# Altium project FMC-320U-A1.PrjPcb
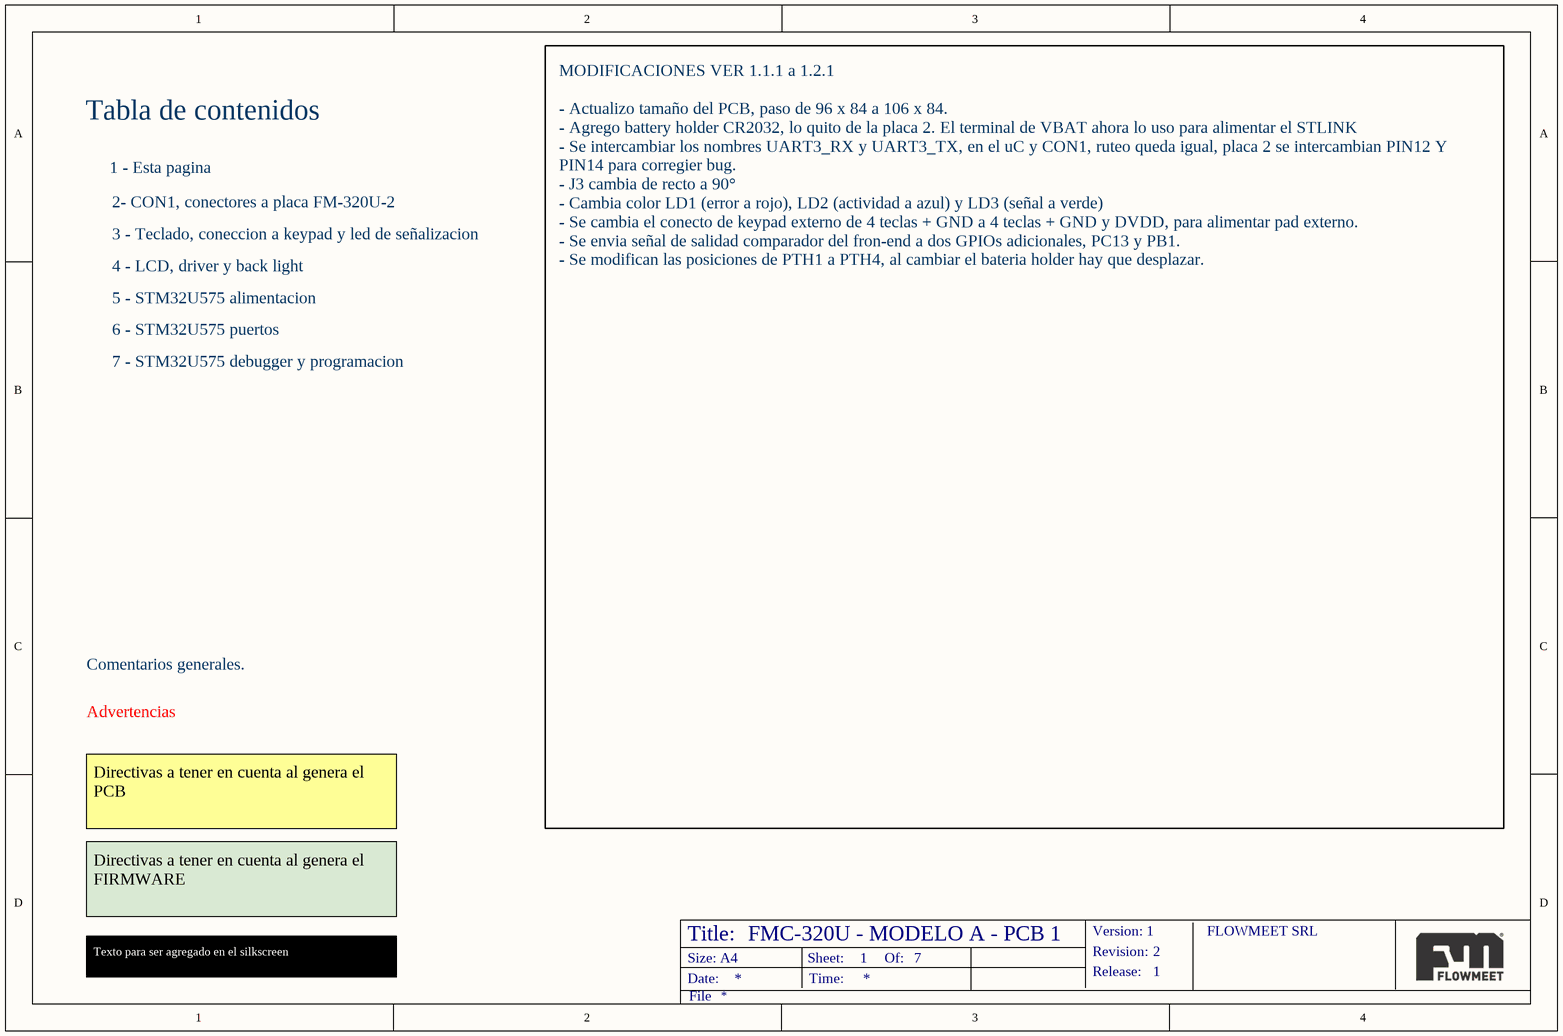
[diagram p0: READ_1.SchDoc]
6 sheets, 70 parts. Net scope: flat (ports and power ports of the same name join across sheets).
Board file: FMC-320U-A1.PcbDoc
Sheets:
  READ_1.SchDoc
  CON1.SchDoc
  KEY.SchDoc
  MCU_PWR.SchDoc
  MCU_IO.SchDoc
  MCU_DBG.SchDoc

## Sheet READ_1.SchDoc: FMC-320U - MODELO A - PCB 1
size A4; SheetNumber: 1; SheetTotal: 7; thisVersion: 1; ThisRevision: 2; ThisRelease: 1

### Notes on the sheet
- Tabla de contenidos
- 1 - Esta pagina
- 2- CON1, conectores a placa FM-320U-2
- 3 - Teclado, coneccion a keypad y led de señalizacion
- 4 - LCD, driver y back light
- 5 - STM32U575 alimentacion
- 6 - STM32U575 puertos
- 7 - STM32U575 debugger y programacion
- Comentarios generales.
- Advertencias
- Directivas a tener en cuenta al genera el PCB
- MODIFICACIONES VER 1.1.1 a 1.2.1
  - Actualizo tamaño del PCB, paso de 96 x 84 a 106 x 84.
  - Agrego battery holder CR2032, lo quito de la placa 2. El terminal de VBAT ahora lo uso para alimentar el STLINK
  - Se intercambiar los nombres UART3_RX y UART3_TX, en el uC y CON1, ruteo queda igual, placa 2 se intercambian PIN12 Y PIN14 para corregier bug.
  - J3 cambia de recto a 90°
  - Cambia color LD1 (error a rojo), LD2 (actividad a azul) y LD3 (señal a verde)
  - Se cambia el conecto de keypad externo de 4 teclas + GND a 4 teclas + GND y DVDD, para alimentar pad externo.
  - Se envia señal de salidad comparador del fron-end a dos GPIOs adicionales, PC13 y PB1.
  - Se modifican las posiciones de PTH1 a PTH4, al cambiar el bateria holder hay que desplazar.
- Directivas a tener en cuenta al genera el FIRMWARE
- Texto para ser agregado en el silkscreen
- Title:
- Size: A4
- Date:
- Sheet:
- Time:
- Of:
- Version:
- Revision:
- Release:
- FLOWMEET SRL
- File

## Sheet CON1.SchDoc
size A4; SheetNumber: 1; SheetTotal: 6
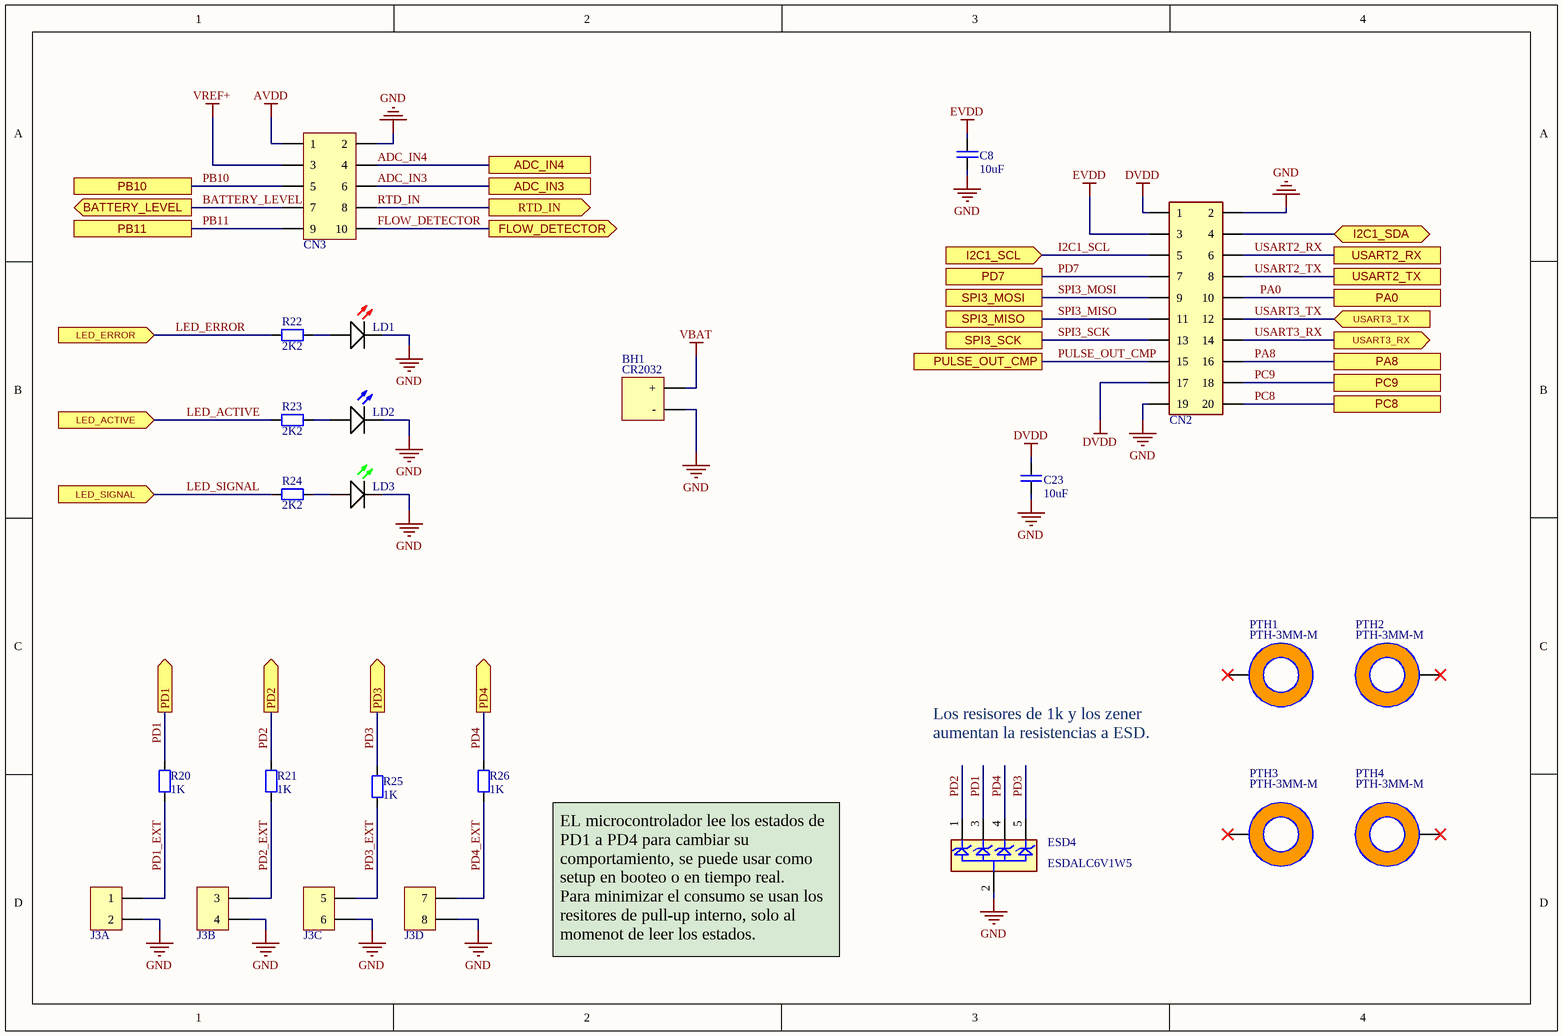
[diagram p1: CON1.SchDoc]

### Parts
BH1  CR2032  [BS-08-B2AA016]
C8  10uF  [CAP_SM0805_YAGEOCC2_N]
C23  10uF  [CAP_SM0805_YAGEOCC2_N]
CN2  DW254R-22-20-85  [DW254R-22-10-85]  (value not drawn)
CN3  DW254S-22-10-85  [2X5 100 MILS SMD]  (value not drawn)
ESD4  ESDALC6V1W5  [ESDALC6V1W5]
J3  PH2.54-07-04PWS-JUMPER  [HEADER PIN 2X4 A 90 GRADOS]  (value not drawn)  (parts A,B,C,D of 4)
LD1  ERROR  [LED 0805]  (value not drawn)
LD2  RUN  [LED 0805]  (value not drawn)
LD3  SGINAL  [LED 0805]  (value not drawn)
PTH1  PTH-3MM-M  [PTH_M3_M]  (no BOM)
PTH2  PTH-3MM-M  [PTH_M3_M]  (no BOM)
PTH3  PTH-3MM-M  [PTH_M3_M]  (no BOM)
PTH4  PTH-3MM-M  [PTH_M3_M]  (no BOM)
R20  1K  [RES_SM0805_YAGEORC_N]
R21  1K  [RES_SM0805_YAGEORC_N]
R22  2K2  [RES_SM0805_YAGEORC_N]
R23  2K2  [RES_SM0805_YAGEORC_N]
R24  2K2  [RES_SM0805_YAGEORC_N]
R25  1K  [RES_SM0805_YAGEORC_N]
R26  1K  [RES_SM0805_YAGEORC_N]

### Ports
ADC_IN3, ADC_IN4, BATTERY_LEVEL (out), FLOW_DETECTOR (out), I2C1_SCL (in), I2C1_SDA (bidir), LED_ACTIVE (in), LED_ERROR (in), LED_SIGNAL (in), PA0, PA8, PB10, PB11, PC8, PC9, PD1 (out), PD2 (out), PD3 (out), PD4 (out), PD7, PULSE_OUT_CMP, RTD_IN (out), SPI3_MISO, SPI3_MOSI, SPI3_SCK, USART2_RX, USART2_TX, USART3_RX (out), USART3_TX (in)

### Nets
AVDD: CN3.1
DVDD: C23.2 CN2.1 CN2.17
EVDD: C8.2 CN2.3
GND: BH1.NEG(-) C8.1 C23.1 CN2.2 CN2.19 CN3.2 ESD4.2(GND) J3.2 J3.4 J3.6 J3.8 LD1.K LD2.K LD3.K
VBAT: BH1.POS(+)
VREF+: CN3.3
ADC_IN3: CN3.6 ; port ADC_IN3
ADC_IN4: CN3.4 ; port ADC_IN4
BATTERY_LEVEL: CN3.7 ; port BATTERY_LEVEL
FLOW_DETECTOR: CN3.10 ; port FLOW_DETECTOR
I2C1_SCL: CN2.5 ; port I2C1_SCL
I2C1_SDA: CN2.4 ; port I2C1_SDA
LED_ACTIVE: R23.1 ; port LED_ACTIVE
LED_ERROR: R22.1 ; port LED_ERROR
LED_SIGNAL: R24.1 ; port LED_SIGNAL
PA0: CN2.10 ; port PA0
PA8: CN2.16 ; port PA8
PB10: CN3.5 ; port PB10
PB11: CN3.9 ; port PB11
PC8: CN2.20 ; port PC8
PC9: CN2.18 ; port PC9
PD1: ESD4.3(I/02) R20.2 ; port PD1
PD1_EXT: J3.1 R20.1
PD2: ESD4.1(I/01) R21.2 ; port PD2
PD2_EXT: J3.3 R21.1
PD3: ESD4.5(I/04) R25.2 ; port PD3
PD3_EXT: J3.5 R25.1
PD4: ESD4.4(I/03) R26.2 ; port PD4
PD4_EXT: J3.7 R26.1
PD7: CN2.7 ; port PD7
PULSE_OUT_CMP: CN2.15 ; port PULSE_OUT_CMP
RTD_IN: CN3.8 ; port RTD_IN
SPI3_MISO: CN2.11 ; port SPI3_MISO
SPI3_MOSI: CN2.9 ; port SPI3_MOSI
SPI3_SCK: CN2.13 ; port SPI3_SCK
USART2_RX: CN2.6 ; port USART2_RX
USART2_TX: CN2.8 ; port USART2_TX
USART3_RX: CN2.14 ; port USART3_RX
USART3_TX: CN2.12 ; port USART3_TX
NetLD1_A: LD1.A R22.2
NetLD2_A: LD2.A R23.2
NetLD3_A: LD3.A R24.2

Not connected (* = marked no-connect by the designer): PTH1 1*; PTH2 1*; PTH3 1*; PTH4 1*

### Notes on the sheet
- Los resisores de 1k y los zener aumentan la resistencias a ESD.
- EL microcontrolador lee los estados de PD1 a PD4 para cambiar su comportamiento, se puede usar como setup en booteo o en tiempo real.
  Para minimizar el consumo se usan los resitores de pull-up interno, solo al momenot de leer los estados.
- Title:
- Size: A4
- Date:
- Sheet:
- Time:
- Of:
- Version:
- Revision:
- Release:
- FLOWMEET SRL
- File

### Library data of the parts
BH1 = BS-08-B2AA016: Battery base -25℃~+85℃ CR2032 SMD Battery Connectors ROHS; Manufacturer: Myoung; Manufacturer part number: BS-08-B2AA016; Category: Battery holder; Datasheet: https://datasheet.lcsc.com/lcsc/2012181809_MYOUNG-BS-08-B2AA016_C964792.pdf; Temperature Max: 85; Temperature Min: -25
C8 C23 = CC0805KKX5R8BB106: CAP 10uF SM0805 X5R 25V YAGEO; Tolerance: 10; Category: Capacitor; Manufacturer: Yageo; Manufacturer Part Number: CC0805KKX5R8BB106; Package: 0805; Value: 10uF; ComponentLink1Description: Manufacturer Website; ComponentLink1URL: http://www.yageo.com; Datasheet: https://datasheet.lcsc.com/lcsc/2304140030_YAGEO-CC0805KKX5R8BB106_C89831.pdf
CN2 = DW254R-22-20-85: 2 x 10 - true hole 2.54mm - altura 8.5mm; Manufacturer: Dealon; Category: Header female; Manufacturer Part Number: DW254R-22-20-85; Main supplier: LCSC
CN3 = DW254S-22-10-85: 2 x 5 - SMD 2.54mm - altura 8.5mm; Manufacturer: Dealon; Category: Header female; Manufacturer Part Number: DW254S-22-10-85; Main supplier: LCSC
ESD4 = ESDALC6V1W5: TVS Diode Array Uni-Directional 6.1V / QTY 5 per pack, SOT-323 / Ranking 5: / Marca reconocida. / Usado en placas nucleo, sometidas a manipuleo nunca note un pin quemado por ESD.; Manufacturer: ST; Manufacturer Part Number: ESDALC6V1W5; Category: Diodo; Datasheet: https://www.st.com/content/ccc/resource/technical/document/datasheet/32/30/02/e6/ac/0f/46/c2/CD00002946.pdf/files/CD00002946.pdf/jcr:content/translations/en.CD00002946.pdf; Temperature Max: 150; Temperature Min: -40
J3 = PH2.54-07-04PWS-JUMPER: 2 x 4 - true hole  2.54mm 90°; Manufacturer: XUNPU; Manufacturer Part Number: PH2.54-07-04PWS; Category: Header pin
LD1 = 17-21SURC/S530-A2/TR8: Manufacturer: Everlight Elec; Manufacturer Part Number: 17-21SURC/S530-A2/TR8; Category: LED; Main supplier: LCSC
LD2 = 17-21/BHC-XL2M2TY/3T: Manufacturer: Everlight Elec; Manufacturer Part Number: 17-21/BHC-XL2M2TY; Category: LED; Datasheet: https://datasheet.lcsc.com/lcsc/1809192317_Everlight-Elec-17-21-BHC-XL2M2TY-3T_C72035.pdf; Temperature Max: 85; Temperature Min: -40; Main supplier: LCSC
LD3 = 17-21SYGC/S530-E2/TR8: Manufacturer: Everlight Elec; Manufacturer Part Number: 17-21SYGC/S530-E2/TR8; Category: LED; Datasheet: https://mm.digikey.com/Volume0/opasdata/d220001/medias/docus/559/17-21SYGC,S530-E2,TR8.pdf; Temperature Max: 85; Temperature Min: -40; Main supplier: LCSC
PTH1-PTH4 = PTH-3MM-M: Agujero de montaje metalizado roscas M3. Drill de tamaño medio.; Category: Mounting Hole; Temperature Max: -; Temperature Min: -
R20 R21 R25 R26 = RC0805FR-071KL: RES 1K SM0805 YAGEO RC_L; Power (Watts): 0.125; Resistance (Ohms): 1000; Tolerance (%): 1; Category: Resistor; Manufacturer: Yageo; Manufacturer Part Number: RC0805FR-071KL; Package: 0805; Value: 1K; Supplier Part Number 1: 9237496; Supplier 1: Farnell; ComponentLink1URL: http://www.yageo.com; ComponentLink1Description: Manufacturer Website; Supplier 2: Digi-Key; Supplier Part Number 2: 311-1.00KCRCT-ND; Datasheet: https://www.yageo.com/upload/media/product/app/datasheet/rchip/pyu-rc_group_51_rohs_l.pdf
R22-R24 = RC0805FR-072K2L: RES 2K2 SM0805 YAGEO RC_L; Power (Watts): 0.125; Resistance (Ohms): 2200; Tolerance (%): 1; Category: Resistor; Manufacturer: Yageo; Manufacturer Part Number: RC0805FR-072K2L; Package: 0805; Value: 2K2; Supplier Part Number 1: 9237534; Supplier 1: Farnell; ComponentLink1Description: Manufacturer Website; ComponentLink1URL: http://www.yageo.com; Supplier 2: Digi-Key; Supplier Part Number 2: 311-2.20KCRCT-ND

## Sheet KEY.SchDoc: FMC-320U-A-01
size A4; =address1: Author: DHS; Approved By: ???; Checked By: ???; Address1fd: L3, 12a Rodborough Rd; SheetNumber: 1; SheetTotal: 5; thisVersion: 1; thisRelease: 0; thisRevision: 0
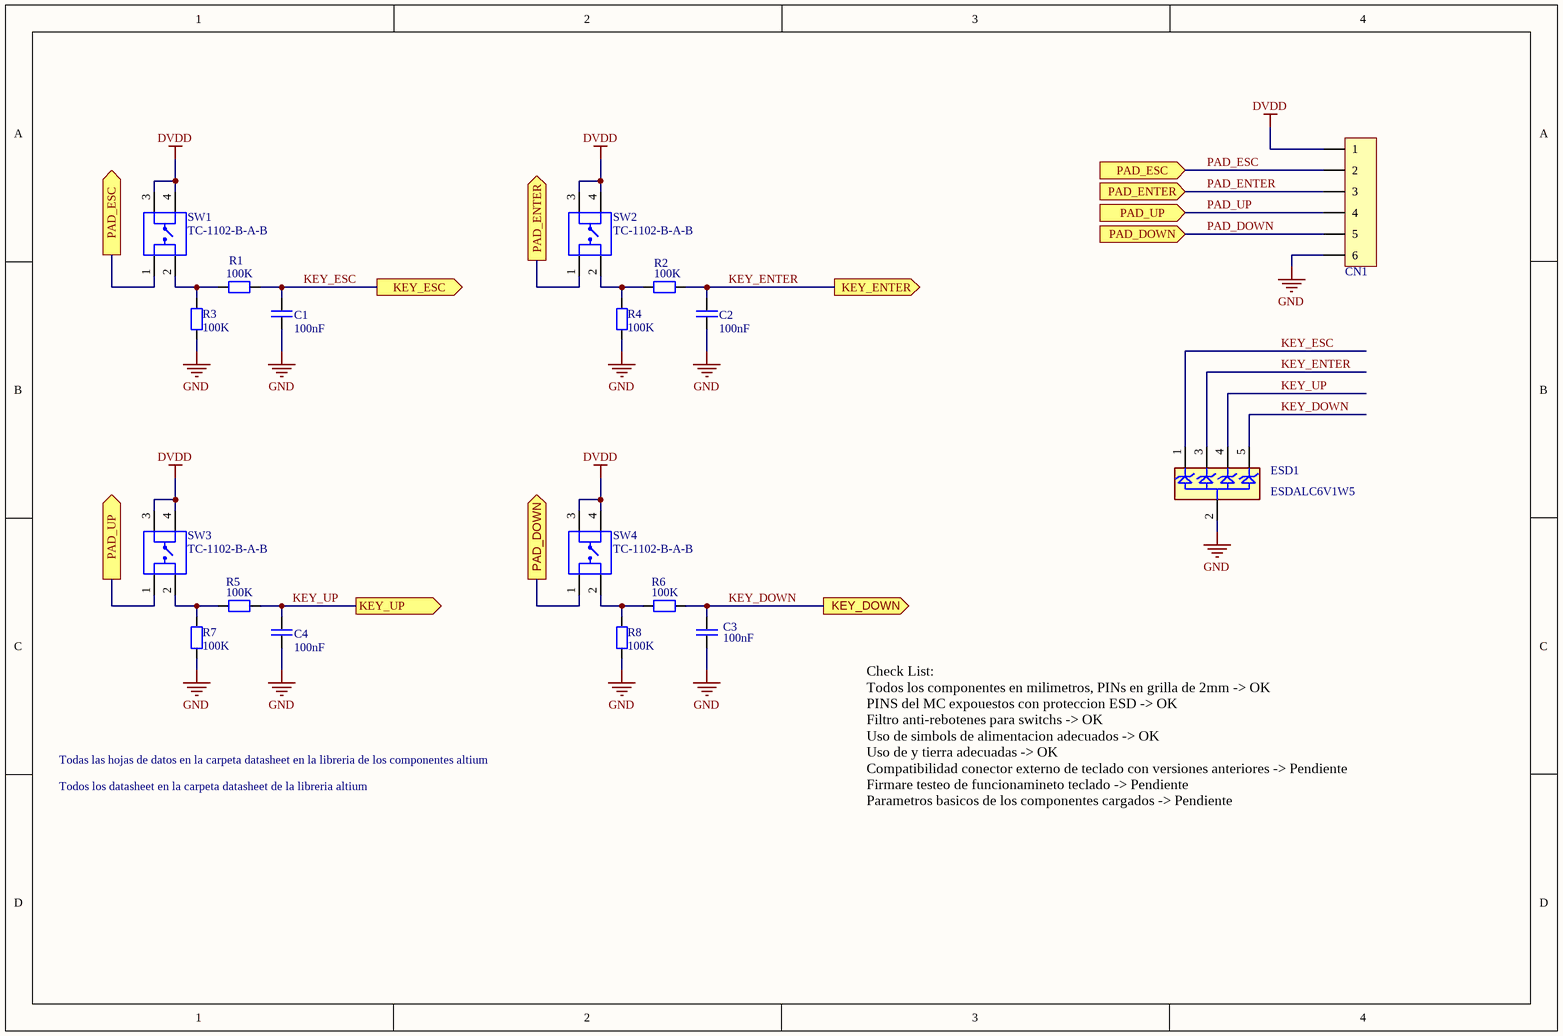
[diagram p2: KEY.SchDoc]

### Parts
C1  100nF  [CAP_SM0805_YAGEOCC2_N]
C2  100nF  [CAP_SM0805_YAGEOCC2_N]
C3  100nF  [CAP_SM0805_YAGEOCC2_N]
C4  100nF  [CAP_SM0805_YAGEOCC2_N]
CN1  PH2.54-07-06PWD  [HEADER PIN 1X6 A 90 GRADOS]  (value not drawn)
ESD1  ESDALC6V1W5  [ESDALC6V1W5]
R1  100K  [RES_SM0805_YAGEORC_N]
R2  100K  [RES_SM0805_YAGEORC_N]
R3  100K  [RES_SM0805_YAGEORC_N]
R4  100K  [RES_SM0805_YAGEORC_N]
R5  100K  [RES_SM0805_YAGEORC_N]
R6  100K  [RES_SM0805_YAGEORC_N]
R7  100K  [RES_SM0805_YAGEORC_N]
R8  100K  [RES_SM0805_YAGEORC_N]
SW1  TC-1102-B-A-B  [TC-1102-B-A-B]
SW2  TC-1102-B-A-B  [TC-1102-B-A-B]
SW3  TC-1102-B-A-B  [TC-1102-B-A-B]
SW4  TC-1102-B-A-B  [TC-1102-B-A-B]

### Ports
KEY_DOWN (out), KEY_ENTER (out), KEY_ESC (out), KEY_UP (out), PAD_DOWN (in), PAD_DOWN (out), PAD_ENTER (in), PAD_ENTER (out), PAD_ESC (in), PAD_ESC (out), PAD_UP (in), PAD_UP (out)

### Nets
DVDD: CN1.1 SW1.3(g) SW1.4 SW2.3(g) SW2.4 SW3.3(g) SW3.4 SW4.3(g) SW4.4
GND: C1.2 C2.2 C3.2 C4.2 CN1.6 ESD1.2(GND) R3.1 R4.1 R7.1 R8.1
KEY_DOWN: C3.1 ESD1.5(I/04) R6.2 ; port KEY_DOWN
KEY_ENTER: C2.1 ESD1.3(I/02) R2.2 ; port KEY_ENTER
KEY_ESC: C1.1 ESD1.1(I/01) R1.2 ; port KEY_ESC
KEY_UP: C4.1 ESD1.4(I/03) R5.2 ; port KEY_UP
PAD_DOWN: CN1.5 SW4.1 ; port PAD_DOWN
PAD_ENTER: CN1.3 SW2.1 ; port PAD_ENTER
PAD_ESC: CN1.2 SW1.1 ; port PAD_ESC
PAD_UP: CN1.4 SW3.1 ; port PAD_UP
NetR1_1: R1.1 R3.2 SW1.2
NetR2_1: R2.1 R4.2 SW2.2
NetR5_1: R5.1 R7.2 SW3.2
NetR6_1: R6.1 R8.2 SW4.2

### Notes on the sheet
- Todos los datasheet en la carpeta datasheet de la libreria altium
- Todas las hojas de datos en la carpeta datasheet en la libreria de los componentes altium
- Check List:
  Todos los componentes en milimetros, PINs en grilla de 2mm -> OK
  PINS del MC expouestos con proteccion ESD -> OK
  Filtro anti-rebotenes para switchs -> OK
  Uso de simbols de alimentacion adecuados -> OK
  Uso de y tierra adecuadas -> OK
  Compatibilidad conector externo de teclado con versiones anteriores -> Pendiente
  Firmare testeo de funcionamineto teclado -> Pendiente
  Parametros basicos de los componentes cargados -> Pendiente
- Title:
- Size: A4
- Date:
- Sheet:
- Time:
- Of:
- Version:
- Revision:
- Release:
- FLOWMEET SRL
- File

### Library data of the parts
C1-C4 = CC0805KRX7R8BB104: CAP 100nF SM0805 X7R 25V YAGEO CC2; Tolerance (%): 10; Voltage Rating (Volts): 25; Category: Capacitor; Manufacturer: Yageo; Manufacturer Part Number: CC0805KRX7R8BB104; Package: 0805; Value: 100nF; Supplier Part Number 1: 644249; Supplier 1: Farnell; ComponentLink1URL: http://www.yageo.com; ComponentLink1Description: Manufacturer Website; Supplier 2: Digi-Key; Supplier Part Number 2: 311-1141-1-ND; Datasheet: https://datasheet.lcsc.com/lcsc/2006111832_YAGEO-CC0805KRX7R8BB104_C519981.pdf
CN1 = PH2.54-07-06PWD: 1 x 6 - true hole  2.54mm - Pb free - 90°; Manufacturer: XUNPU; Manufacturer Part Number: PH2.54-07-06PWD; Category: Header pin; Datasheet: https://datasheet.lcsc.com/lcsc/2202082130_Amphenol-ICC-54101-T06-00_C213463.pdf; Temperature Max: 125; Temperature Min: -65
ESD1 = ESDALC6V1W5: as ESD4 on sheet CON1; Manufacturer Part Number: ESDALC6V1W5; Category: Diodo; Datasheet: https://www.st.com/content/ccc/resource/technical/document/datasheet/32/30/02/e6/ac/0f/46/c2/CD00002946.pdf/files/CD00002946.pdf/jcr:content/translations/en.CD00002946.pdf; Temperature Max: 150; Temperature Min: -40
R1-R8 = RC0805FR-07100KL: RES 100K SM0805 YAGEO RC_L; Power (Watts): 0.125; Resistance (Ohms): 100000; Tolerance (%): 1; Category: Resistor; Manufacturer: Yageo; Manufacturer Part Number: RC0805FR-07100KL; Package: 0805; Value: 100K; Supplier Part Number 1: 9237879; Supplier 1: Farnell; ComponentLink1Description: Manufacturer Website; ComponentLink1URL: http://www.yageo.com; Supplier 2: Digi-Key; Supplier Part Number 2: 311-100KCRCT-ND; Datasheet: https://www.yageo.com/upload/media/product/app/datasheet/rchip/pyu-rc_group_51_rohs_l.pdf
SW1-SW4 = TC-1102-B-A-B: Switch tactile 6x6mm true hole.; Manufacturer: XKB Connectivity; Category: Mechanical Switch; Manufacturer Part Number: TC-1102-B-A-B; Datasheet: https://datasheet.lcsc.com/lcsc/2110111230_XKB-Connectivity-TC-1102-B-A-B_C480281.pdf; Temperature Max: 85; Temperature Min: -30
  SW1: Main supplier: LCSC

## Sheet MCU_PWR.SchDoc
size A4; Organization: Altium Limited; Address1: L3, 12a Rodborough Rd; Address2: Frenchs Forest; Address3: NSW; Address4: Australia 2086; SheetNumber: 3; SheetTotal: 5
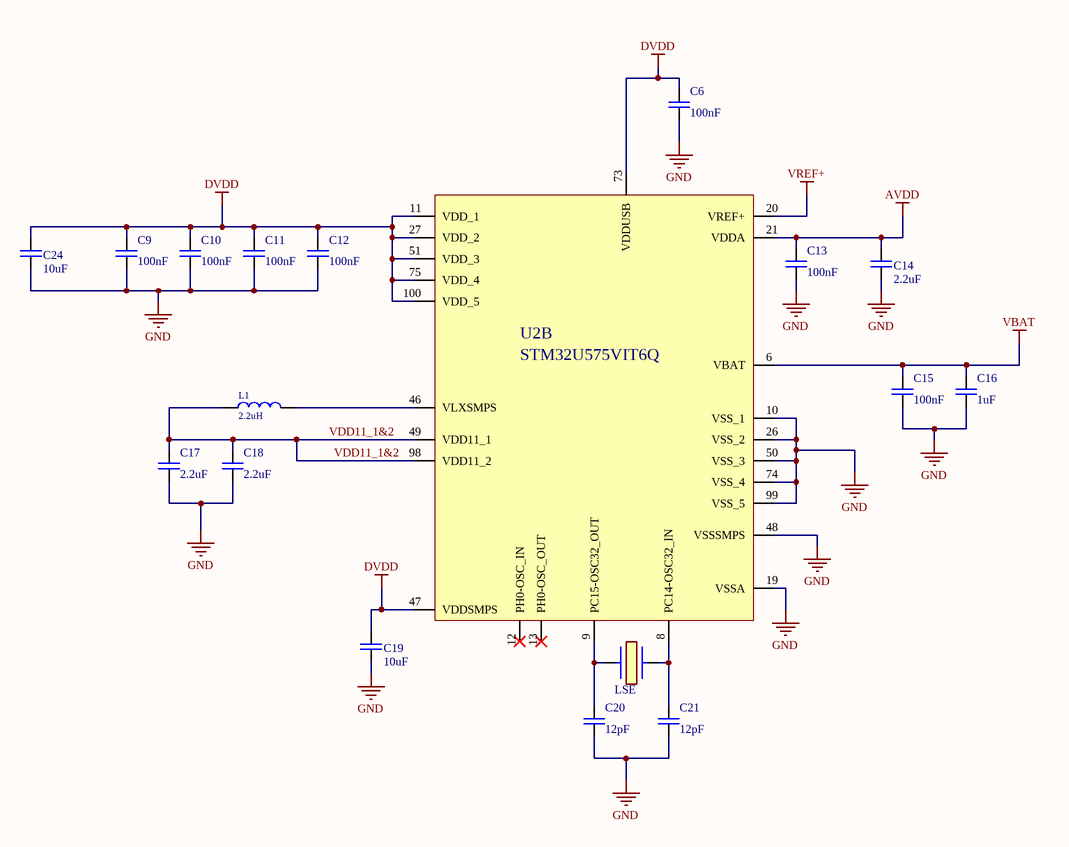
[diagram p3: MCU_PWR.SchDoc]

### Parts
C6  100nF  [CAP_SM0805_YAGEOCC2_N]
C9  100nF  [CAP_SM0805_YAGEOCC2_N]
C10  100nF  [CAP_SM0805_YAGEOCC2_N]
C11  100nF  [CAP_SM0805_YAGEOCC2_N]
C12  100nF  [CAP_SM0805_YAGEOCC2_N]
C13  100nF  [CAP_SM0805_YAGEOCC2_N]
C14  2.2uF  [CAP_SM0805_YAGEOCC2_N]
C15  100nF  [CAP_SM0805_YAGEOCC2_N]
C16  1uF  [CAP_SM0805_YAGEOCC2_N]
C17  2.2uF  [CAP_SM0805_YAGEOCC2_N]
C18  2.2uF  [CAP_SM0805_YAGEOCC2_N]
C19  10uF  [CAP_SM0805_YAGEOCC2_N]
C20  12pF  [CAP_SM0805_YAGEOCC2_N]
C21  12pF  [CAP_SM0805_YAGEOCC2_N]
C24  10uF  [CAP_SM0805_YAGEOCC2_N]
L1  2.2uH  [LQM21PN2R2MGHL]
LSE  32,768 kHz  [SC-32S32.768kHz20PPM12.5pF]  (value not drawn)
U2  STM32U575VIT6Q  [STM32U575VI]  (part B of 3)

### Nets
AVDD: C13.1 C14.1 U2.21(VDDA)
DVDD: C6.1 C9.1 C10.1 C11.1 C12.1 C19.1 C24.1 U2.11(VDD_1) U2.27(VDD_2) U2.47(VDDSMPS) U2.51(VDD_3) U2.73(VDDUSB) U2.75(VDD_4) U2.100(VDD_5)
GND: C6.2 C9.2 C10.2 C11.2 C12.2 C13.2 C14.2 C15.2 C16.2 C17.2 C18.2 C19.2 C20.2 C21.2 C24.2 U2.10(VSS_1) U2.19(VSSA) U2.26(VSS_2) U2.48(VSSSMPS) U2.50(VSS_3) U2.74(VSS_4) U2.99(VSS_5)
VBAT: C15.1 C16.1 U2.6(VBAT)
VREF+: U2.20(VREF+)
VDD11_1&2: C17.1 C18.1 L1.1 U2.49(VDD11_1) U2.98(VDD11_2)
NetC20_1: C20.1 LSE.1 U2.9(PC15-OSC32_OUT)
NetC21_1: C21.1 LSE.2 U2.8(PC14-OSC32_IN)
NetL1_2: L1.2 U2.46(VLXSMPS)

Not connected (* = marked no-connect by the designer): U2 12(PH0-OSC_IN)* 13(PH0-OSC_OUT)*

### Notes on the sheet
- Title:
- Size: A4
- Date:
- FMC-320U MODEL A
- Sheet:
- Time:
- Of:
- Version:
- Revision:
- Release:
- 1
- 0
- FLOWMEET SRL
- File

### Library data of the parts
C6 C9-C13 C15 = CC0805KRX7R9BB104: CAP 100nF SM0805 X7R 50V YAGEO CC2; Tolerance (%): 10; Voltage Rating (Volts): 50; Category: Capacitor; Manufacturer: Yageo; Manufacturer Part Number: CC0805KRX7R9BB104; Package: 0805; Value: 100nF; Supplier Part Number 1: 3019949; Supplier 1: Farnell; ComponentLink1URL: http://www.yageo.com; ComponentLink1Description: Manufacturer Website; Supplier 2: Digi-Key; Supplier Part Number 2: 311-1140-1-ND
C14 C17 C18 = CC0805KKX7R8BB225: CAP 2u2F SM0805 X7R 25V YAGEO CC2; Tolerance (%): 10; Voltage Rating (Volts): 25; Category: Capacitor; Manufacturer: Yageo; Manufacturer Part Number: CC0805KKX7R8BB225; Package: 0805; Value: 2.2uF; Supplier Part Number 1: 1458904; Supplier 1: Farnell; ComponentLink1URL: http://www.yageo.com; ComponentLink1Description: Manufacturer Website; Supplier 2: Digi-Key
C16 = CC0805KKX7R8BB105: CAP 1uF SM0805 X7R 25V YAGEO CC2; Tolerance (%): 10; Voltage Rating (Volts): 25; Category: Capacitor; Manufacturer: Yageo; Manufacturer Part Number: CC0805KKX7R8BB105; Package: 0805; Value: 1uF; Supplier Part Number 1: 1458903; Supplier 1: Farnell; ComponentLink1URL: http://www.yageo.com; ComponentLink1Description: Manufacturer Website; Supplier 2: Digi-Key; Supplier Part Number 2: 311-1456-1-ND; Datasheet: https://datasheet.lcsc.com/lcsc/2304140030_YAGEO-CC0805KKX7R8BB105_C91186.pdf
C19 C24 = CC0805KKX5R8BB106: as C8 on sheet CON1; Category: Capacitor; Manufacturer: Yageo; Manufacturer Part Number: CC0805KKX5R8BB106; Package: 0805; Value: 10uF; ComponentLink1Description: Manufacturer Website; ComponentLink1URL: http://www.yageo.com; Datasheet: https://datasheet.lcsc.com/lcsc/2304140030_YAGEO-CC0805KKX5R8BB106_C89831.pdf
C20 C21 = CC0805JRNPO9BN120: CAP 12pF SM0805 NPO 50V YAGEO CC2; Tolerance (%): 5; Voltage Rating (Volts): 50; Category: Capacitor; Manufacturer: Yageo; Manufacturer Part Number: CC0805JRNPO9BN120; Package: 0805; Value: 12pF; ComponentLink1URL: http://www.yageo.com; ComponentLink1Description: Manufacturer Website
L1 = LQM21PN2R2MGHL: Inductores de potencia - SMD 2.2 UH 20%; Manufacturer: Murata Electronics; Manufacturer Part Number: LQM21PN2R2MGHL; Category: Inductor; Value: 2.2uH; Datasheet: https://ar.mouser.com/datasheet/2/281/1/JELF243B_0040-961444.pdf; Temperature Max: 85; Temperature Min: -40
LSE = SC32S-12.5PF20PPM: Cristal Oscilador 32.768 kHz, 12.5pF; Manufacturer: Seiko; Manufacturer Part Number: SC32S-12.5PF20PPM; Category: Cristal Oscilador; Value: 32,768 kHz; Datasheet: https://datasheet.lcsc.com/lcsc/1811151435_Seiko-SC-32S32-768kHz20PPM12-5pF_C97606.pdf; Temperature Max: 85; Temperature Min: -40
U2 = STM32U575VI_1: Manufacturer: ST; Manufacturer Part Number: STM32U575VIT6Q; Category: Microcontrolador; Datasheet: https://www.st.com/resource/en/datasheet/stm32u575ag.pdf; Temperature Max: 85; Temperature Min: -40

## Sheet MCU_IO.SchDoc
size A4; Organization: Altium Limited; Address1: L3, 12a Rodborough Rd; Address2: Frenchs Forest; Address3: NSW; Address4: Australia 2086; SheetNumber: 4; SheetTotal: 5
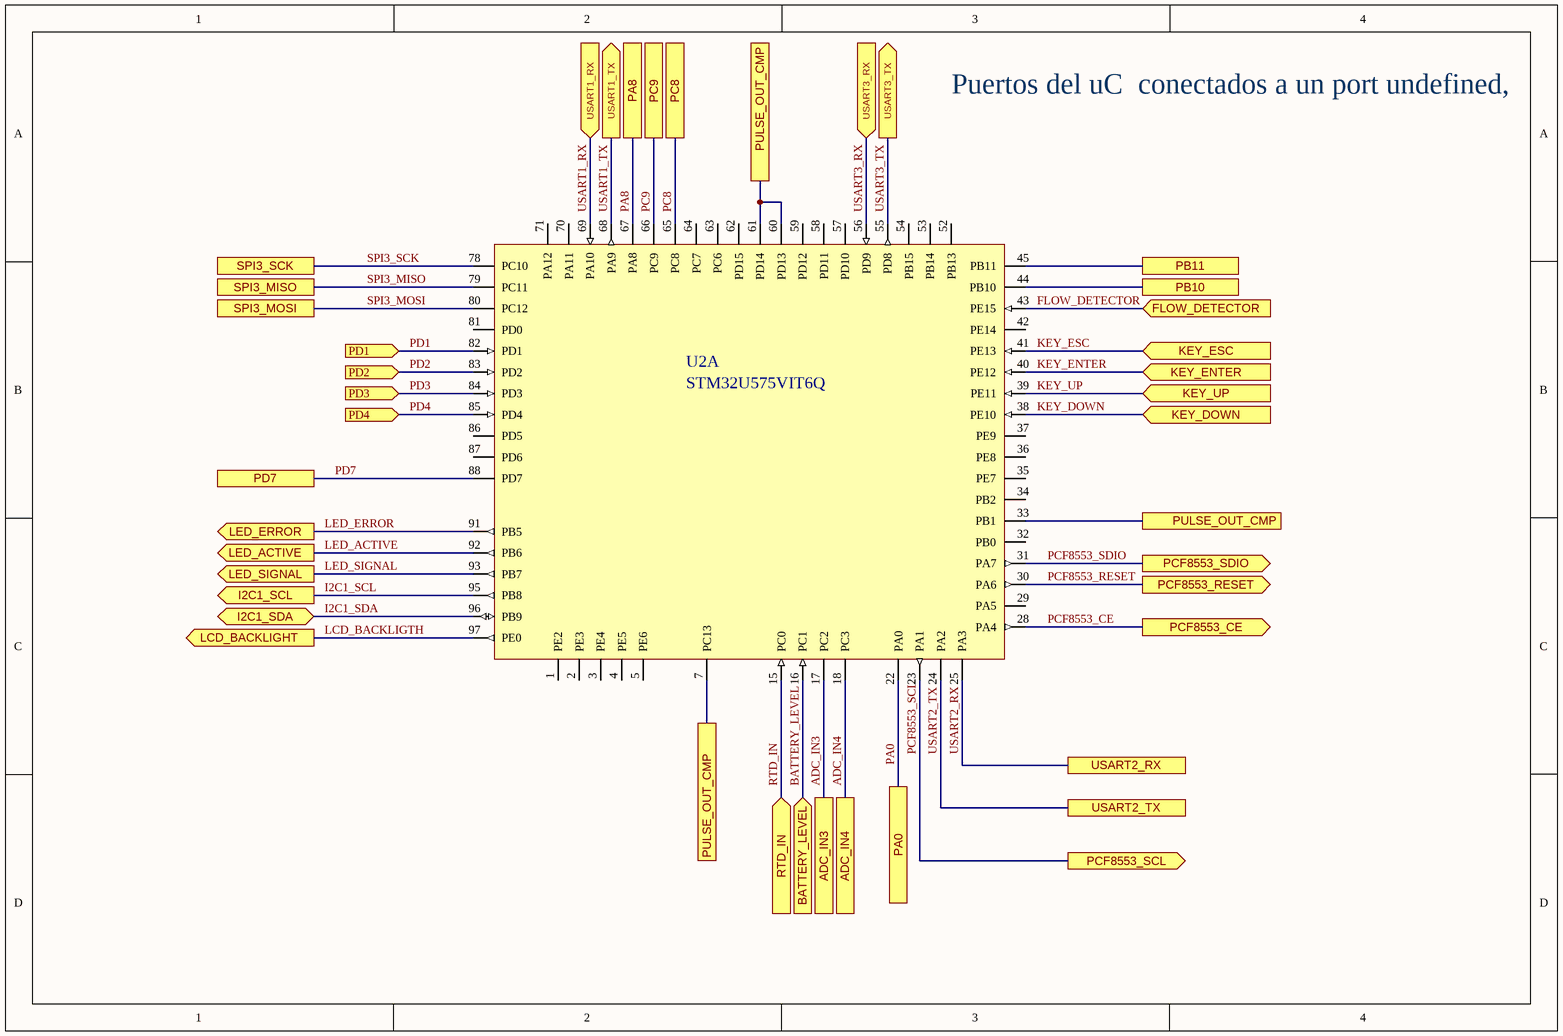
[diagram p4: MCU_IO.SchDoc]

### Parts
U2  STM32U575VIT6Q  [STM32U575VI]  (part A of 3)

### Ports
ADC_IN3, ADC_IN4, BATTERY_LEVEL (in), FLOW_DETECTOR (in), I2C1_SCL (out), I2C1_SDA (bidir), KEY_DOWN (in), KEY_ENTER (in), KEY_ESC (in), KEY_UP (in), LCD_BACKLIGHT (out), LED_ACTIVE (out), LED_ERROR (out), LED_SIGNAL (out), PA0, PA8, PB10, PB11, PC8, PC9, PCF8553_CE (out), PCF8553_RESET (out), PCF8553_SCL (out), PCF8553_SDIO (out), PD1 (in), PD2 (in), PD3 (in), PD4 (in), PD7, PULSE_OUT_CMP, RTD_IN (in), SPI3_MISO, SPI3_MOSI, SPI3_SCK, USART1_RX (in), USART1_TX (out), USART2_RX, USART2_TX, USART3_RX (in), USART3_TX (out)

### Nets
ADC_IN3: U2.17(PC2) ; port ADC_IN3
ADC_IN4: U2.18(PC3) ; port ADC_IN4
BATTERY_LEVEL: U2.16(PC1) ; port BATTERY_LEVEL
FLOW_DETECTOR: U2.43(PE15) ; port FLOW_DETECTOR
I2C1_SCL: U2.95(PB8) ; port I2C1_SCL
I2C1_SDA: U2.96(PB9) ; port I2C1_SDA
KEY_DOWN: U2.38(PE10) ; port KEY_DOWN
KEY_ENTER: U2.40(PE12) ; port KEY_ENTER
KEY_ESC: U2.41(PE13) ; port KEY_ESC
KEY_UP: U2.39(PE11) ; port KEY_UP
LCD_BACKLIGTH: U2.97(PE0) ; port LCD_BACKLIGHT
LED_ACTIVE: U2.92(PB6) ; port LED_ACTIVE
LED_ERROR: U2.91(PB5) ; port LED_ERROR
LED_SIGNAL: U2.93(PB7) ; port LED_SIGNAL
PA0: U2.22(PA0) ; port PA0
PA8: U2.67(PA8) ; port PA8
PB10: U2.44(PB10) ; port PB10
PB11: U2.45(PB11) ; port PB11
PC8: U2.65(PC8) ; port PC8
PC9: U2.66(PC9) ; port PC9
PCF8553_CE: U2.28(PA4) ; port PCF8553_CE
PCF8553_RESET: U2.30(PA6) ; port PCF8553_RESET
PCF8553_SCL: U2.23(PA1) ; port PCF8553_SCL
PCF8553_SDIO: U2.31(PA7) ; port PCF8553_SDIO
PD1: U2.82(PD1) ; port PD1
PD2: U2.83(PD2) ; port PD2
PD3: U2.84(PD3) ; port PD3
PD4: U2.85(PD4) ; port PD4
PD7: U2.88(PD7) ; port PD7
PULSE_OUT_CMP: U2.7(PC13) U2.33(PB1) U2.60(PD13) U2.61(PD14) ; port PULSE_OUT_CMP
RTD_IN: U2.15(PC0) ; port RTD_IN
SPI3_MISO: U2.79(PC11) ; port SPI3_MISO
SPI3_MOSI: U2.80(PC12) ; port SPI3_MOSI
SPI3_SCK: U2.78(PC10) ; port SPI3_SCK
USART1_RX: U2.69(PA10) ; port USART1_RX
USART1_TX: U2.68(PA9) ; port USART1_TX
USART2_RX: U2.25(PA3) ; port USART2_RX
USART2_TX: U2.24(PA2) ; port USART2_TX
USART3_RX: U2.56(PD9) ; port USART3_RX
USART3_TX: U2.55(PD8) ; port USART3_TX

Not connected (* = marked no-connect by the designer): U2 1(PE2) 2(PE3) 3(PE4) 4(PE5) 5(PE6) 29(PA5) 32(PB0) 34(PB2) 35(PE7) 36(PE8) 37(PE9) 42(PE14) 52(PB13) 53(PB14) 54(PB15) 57(PD10) 58(PD11) 59(PD12) 62(PD15) 63(PC6) 64(PC7) 70(PA11) 71(PA12) 81(PD0) 86(PD5) 87(PD6)

### Notes on the sheet
- Puertos del uC  conectados a un port undefined, tienen funcion sugerida  pero no definida.
- Title:
- Size: A4
- Date:
- FMC-320U MODEL A
- Sheet:
- Time:
- Of:
- Version:
- Revision:
- Release:
- 1
- 0
- FLOWMEET SRL
- File

### Library data of the parts
U2 = STM32U575VI_1: Manufacturer: ST; Manufacturer Part Number: STM32U575VIT6Q; Category: Microcontrolador; Datasheet: https://www.st.com/resource/en/datasheet/stm32u575ag.pdf; Temperature Max: 85; Temperature Min: -40

## Sheet MCU_DBG.SchDoc
size A4; Organization: Altium Limited; Address1: L3, 12a Rodborough Rd; Address2: Frenchs Forest; Address3: NSW; Address4: Australia 2086; SheetNumber: 5; SheetTotal: 5
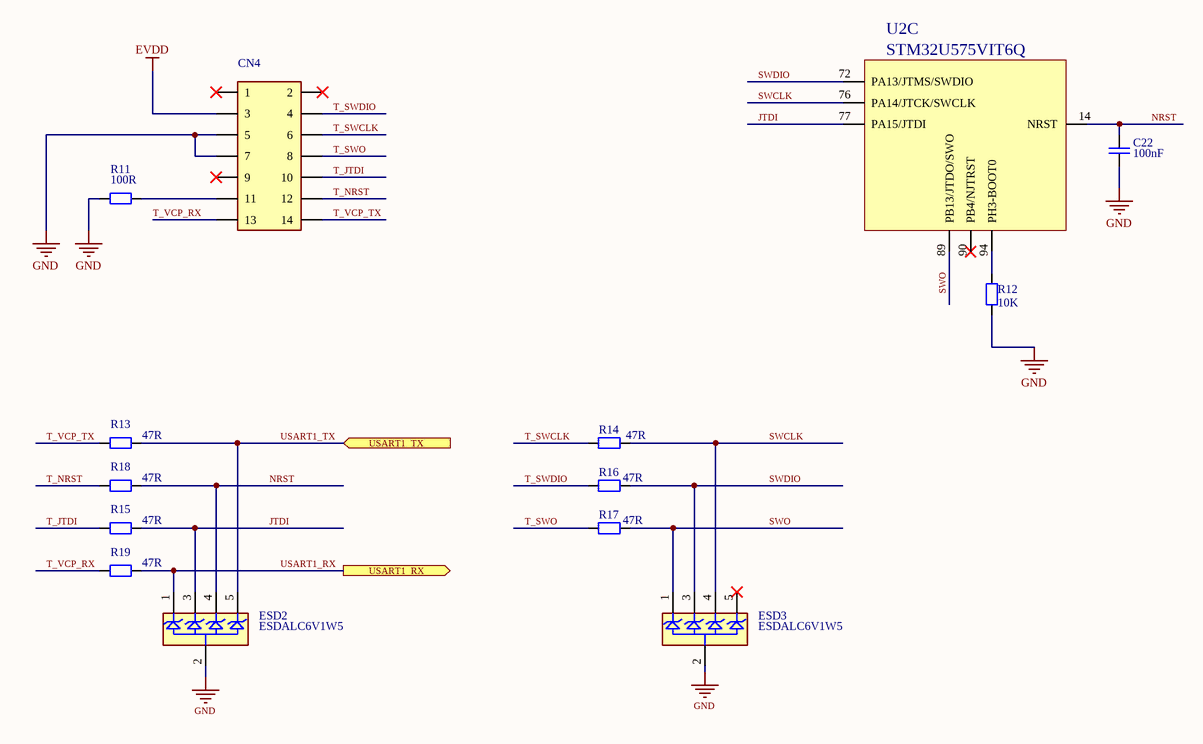
[diagram p5: MCU_DBG.SchDoc]

### Parts
C22  100nF  [CAP_SM0805_YAGEOCC2_N]
CN4  20021511-00014T4LF  [2002151100014T4LF]  (value not drawn)
ESD2  ESDALC6V1W5  [ESDALC6V1W5]
ESD3  ESDALC6V1W5  [ESDALC6V1W5]
R11  100R  [RES_SM0805_YAGEORC_N]
R12  10K  [RES_SM0805_YAGEORC_N]
R13  47R  [RES_SM0805_YAGEORC_N]
R14  47R  [RES_SM0805_YAGEORC_N]
R15  47R  [RES_SM0805_YAGEORC_N]
R16  47R  [RES_SM0805_YAGEORC_N]
R17  47R  [RES_SM0805_YAGEORC_N]
R18  47R  [RES_SM0805_YAGEORC_N]
R19  47R  [RES_SM0805_YAGEORC_N]
U2  STM32U575VIT6Q  [STM32U575VI]  (part C of 3)

### Ports
USART1_RX (out), USART1_TX (in)

### Nets
EVDD: CN4.3
GND: C22.2 CN4.5 CN4.7 ESD2.2(GND) ESD3.2(GND) R11.1 R12.1
JTDI: ESD2.3(I/02) R15.2 U2.77(PA15/JTDI)
NRST: C22.1 ESD2.4(I/03) R18.2 U2.14(NRST)
SWCLK: ESD3.4(I/03) R14.2 U2.76(PA14/JTCK/SWCLK)
SWDIO: ESD3.3(I/02) R16.2 U2.72(PA13/JTMS/SWDIO)
SWO: ESD3.1(I/01) R17.2 U2.89(PB13/JTDO/SWO)
T_JTDI: CN4.10 R15.1
T_NRST: CN4.12 R18.1
T_SWCLK: CN4.6 R14.1
T_SWDIO: CN4.4 R16.1
T_SWO: CN4.8 R17.1
T_VCP_RX: CN4.13 R19.1
T_VCP_TX: CN4.14 R13.1
USART1_RX: ESD2.1(I/01) R19.2 ; port USART1_RX
USART1_TX: ESD2.5(I/04) R13.2 ; port USART1_TX
NetCN4_11: CN4.11 R11.2
NetR12_2: R12.2 U2.94(PH3-BOOT0)

Not connected (* = marked no-connect by the designer): CN4 1* 2* 9*; ESD3 5(I/04)*; U2 90(PB4/NJTRST)*

### Notes on the sheet
- Title:
- Size: A4
- Date:
- FMC-320U MODEL A
- Sheet:
- Time:
- Of:
- Version:
- Revision:
- Release:
- 1
- 0
- FLOWMEET SRL
- File

### Library data of the parts
C22 = CC0805KRX7R9BB104: as C6 on sheet MCU_PWR; Category: Capacitor; Manufacturer: Yageo; Manufacturer Part Number: CC0805KRX7R9BB104; Package: 0805; Value: 100nF; Supplier Part Number 1: 3019949; Supplier 1: Farnell; ComponentLink1URL: http://www.yageo.com; ComponentLink1Description: Manufacturer Website; Supplier 2: Digi-Key; Supplier Part Number 2: 311-1140-1-ND
CN4 = 20021511-00014T4LF: 1.27mm (0.05in.) pitch, Shrouded header, 14 contacts; Manufacturer: Amphenol ICC; Manufacturer Part Number: 20021511-00014T4LF; Category: Header Shrouded; Datasheet: https://cdn.amphenol-cs.com/media/wysiwyg/files/drawing/20021511.pdf; Temperature Max: 85; Temperature Min: -45
ESD2 ESD3 = ESDALC6V1W5: as ESD4 on sheet CON1; Manufacturer Part Number: ESDALC6V1W5; Category: Diodo; Datasheet: https://www.st.com/content/ccc/resource/technical/document/datasheet/32/30/02/e6/ac/0f/46/c2/CD00002946.pdf/files/CD00002946.pdf/jcr:content/translations/en.CD00002946.pdf; Temperature Max: 150; Temperature Min: -40
R11 = RC0805FR-07100RL: RES 100R SM0805 YAGEO RC_L; Power (Watts): 0.125; Resistance (Ohms): 100; Tolerance (%): 1; Category: Resistor; Manufacturer: Yageo; Manufacturer Part Number: RC0805FR-07100RL; Package: 0805; Value: 100R; Supplier Part Number 1: 9237364; Supplier 1: Farnell; ComponentLink1Description: Manufacturer Website; ComponentLink1URL: http://www.yageo.com; Supplier 2: Digi-Key; Supplier Part Number 2: 311-100CRCT-ND; Datasheet: https://www.yageo.com/upload/media/product/productsearch/datasheet/rchip/PYu-RC_Group_51_RoHS_L_12.pdf
R12 = RC0805FR-0710KL: RES 10K SM0805 YAGEO RC_L; Power (Watts): 0.125; Resistance (Ohms): 10000; Tolerance (%): 1; Category: Resistor; Manufacturer: Yageo; Manufacturer Part Number: RC0805FR-0710KL; Package: 0805; Value: 10K; Supplier Part Number 1: 9237755; Supplier 1: Farnell; ComponentLink1Description: Manufacturer Website; ComponentLink1URL: http://www.yageo.com; Supplier 2: Digi-Key; Supplier Part Number 2: 311-10.0KCRCT-ND; Datasheet: https://www.yageo.com/upload/media/product/app/datasheet/rchip/pyu-rc_group_51_rohs_l.pdf
R13-R19 = RC0805FR-0747RL: RES 47R SM0805 YAGEO RC_L; Power (Watts): 0.125; Resistance (Ohms): 47; Tolerance (%): 1; Category: Resistor; Manufacturer: Yageo; Manufacturer Part Number: RC0805FR-0747RL; Package: 0805; Value: 47R; Supplier Part Number 1: 9237321; Supplier 1: Farnell; ComponentLink1Description: Manufacturer Website; ComponentLink1URL: http://www.yageo.com; Supplier 2: Digi-Key; Supplier Part Number 2: 311-47.0CRCT-ND; Datasheet: https://www.yageo.com/upload/media/product/app/datasheet/rchip/pyu-rc_group_51_rohs_l.pdf
U2 = STM32U575VI_1: Manufacturer: ST; Manufacturer Part Number: STM32U575VIT6Q; Category: Microcontrolador; Datasheet: https://www.st.com/resource/en/datasheet/stm32u575ag.pdf; Temperature Max: 85; Temperature Min: -40

## Nets that join several sheets
AVDD: CON1 (CN3.1), MCU_PWR (C13.1 C14.1 U2.21)
DVDD: CON1 (C23.2 CN2.1 CN2.17), KEY (9 pins), MCU_PWR (14 pins)
EVDD: CON1 (C8.2 CN2.3), MCU_DBG (CN4.3)
GND: CON1 (14 pins), KEY (10 pins), MCU_PWR (22 pins), MCU_DBG (7 pins)
VBAT: CON1 (BH1.POS), MCU_PWR (C15.1 C16.1 U2.6)
VREF+: CON1 (CN3.3), MCU_PWR (U2.20)
ADC_IN3: CON1 (CN3.6), MCU_IO (U2.17)
ADC_IN4: CON1 (CN3.4), MCU_IO (U2.18)
BATTERY_LEVEL: CON1 (CN3.7), MCU_IO (U2.16)
FLOW_DETECTOR: CON1 (CN3.10), MCU_IO (U2.43)
I2C1_SCL: CON1 (CN2.5), MCU_IO (U2.95)
I2C1_SDA: CON1 (CN2.4), MCU_IO (U2.96)
KEY_DOWN: KEY (C3.1 ESD1.5 R6.2), MCU_IO (U2.38)
KEY_ENTER: KEY (C2.1 ESD1.3 R2.2), MCU_IO (U2.40)
KEY_ESC: KEY (C1.1 ESD1.1 R1.2), MCU_IO (U2.41)
KEY_UP: KEY (C4.1 ESD1.4 R5.2), MCU_IO (U2.39)
LED_ACTIVE: CON1 (R23.1), MCU_IO (U2.92)
LED_ERROR: CON1 (R22.1), MCU_IO (U2.91)
LED_SIGNAL: CON1 (R24.1), MCU_IO (U2.93)
PA0: CON1 (CN2.10), MCU_IO (U2.22)
PA8: CON1 (CN2.16), MCU_IO (U2.67)
PB10: CON1 (CN3.5), MCU_IO (U2.44)
PB11: CON1 (CN3.9), MCU_IO (U2.45)
PC8: CON1 (CN2.20), MCU_IO (U2.65)
PC9: CON1 (CN2.18), MCU_IO (U2.66)
PD1: CON1 (ESD4.3 R20.2), MCU_IO (U2.82)
PD2: CON1 (ESD4.1 R21.2), MCU_IO (U2.83)
PD3: CON1 (ESD4.5 R25.2), MCU_IO (U2.84)
PD4: CON1 (ESD4.4 R26.2), MCU_IO (U2.85)
PD7: CON1 (CN2.7), MCU_IO (U2.88)
PULSE_OUT_CMP: CON1 (CN2.15), MCU_IO (U2.7 U2.33 U2.60 U2.61)
RTD_IN: CON1 (CN3.8), MCU_IO (U2.15)
SPI3_MISO: CON1 (CN2.11), MCU_IO (U2.79)
SPI3_MOSI: CON1 (CN2.9), MCU_IO (U2.80)
SPI3_SCK: CON1 (CN2.13), MCU_IO (U2.78)
USART1_RX: MCU_IO (U2.69), MCU_DBG (ESD2.1 R19.2)
USART1_TX: MCU_IO (U2.68), MCU_DBG (ESD2.5 R13.2)
USART2_RX: CON1 (CN2.6), MCU_IO (U2.25)
USART2_TX: CON1 (CN2.8), MCU_IO (U2.24)
USART3_RX: CON1 (CN2.14), MCU_IO (U2.56)
USART3_TX: CON1 (CN2.12), MCU_IO (U2.55)